# Altium schematic sheet IOT_Fire_Alarm_Sheet.SchDoc
size Letter; SheetNumber: 1; SheetTotal: 1
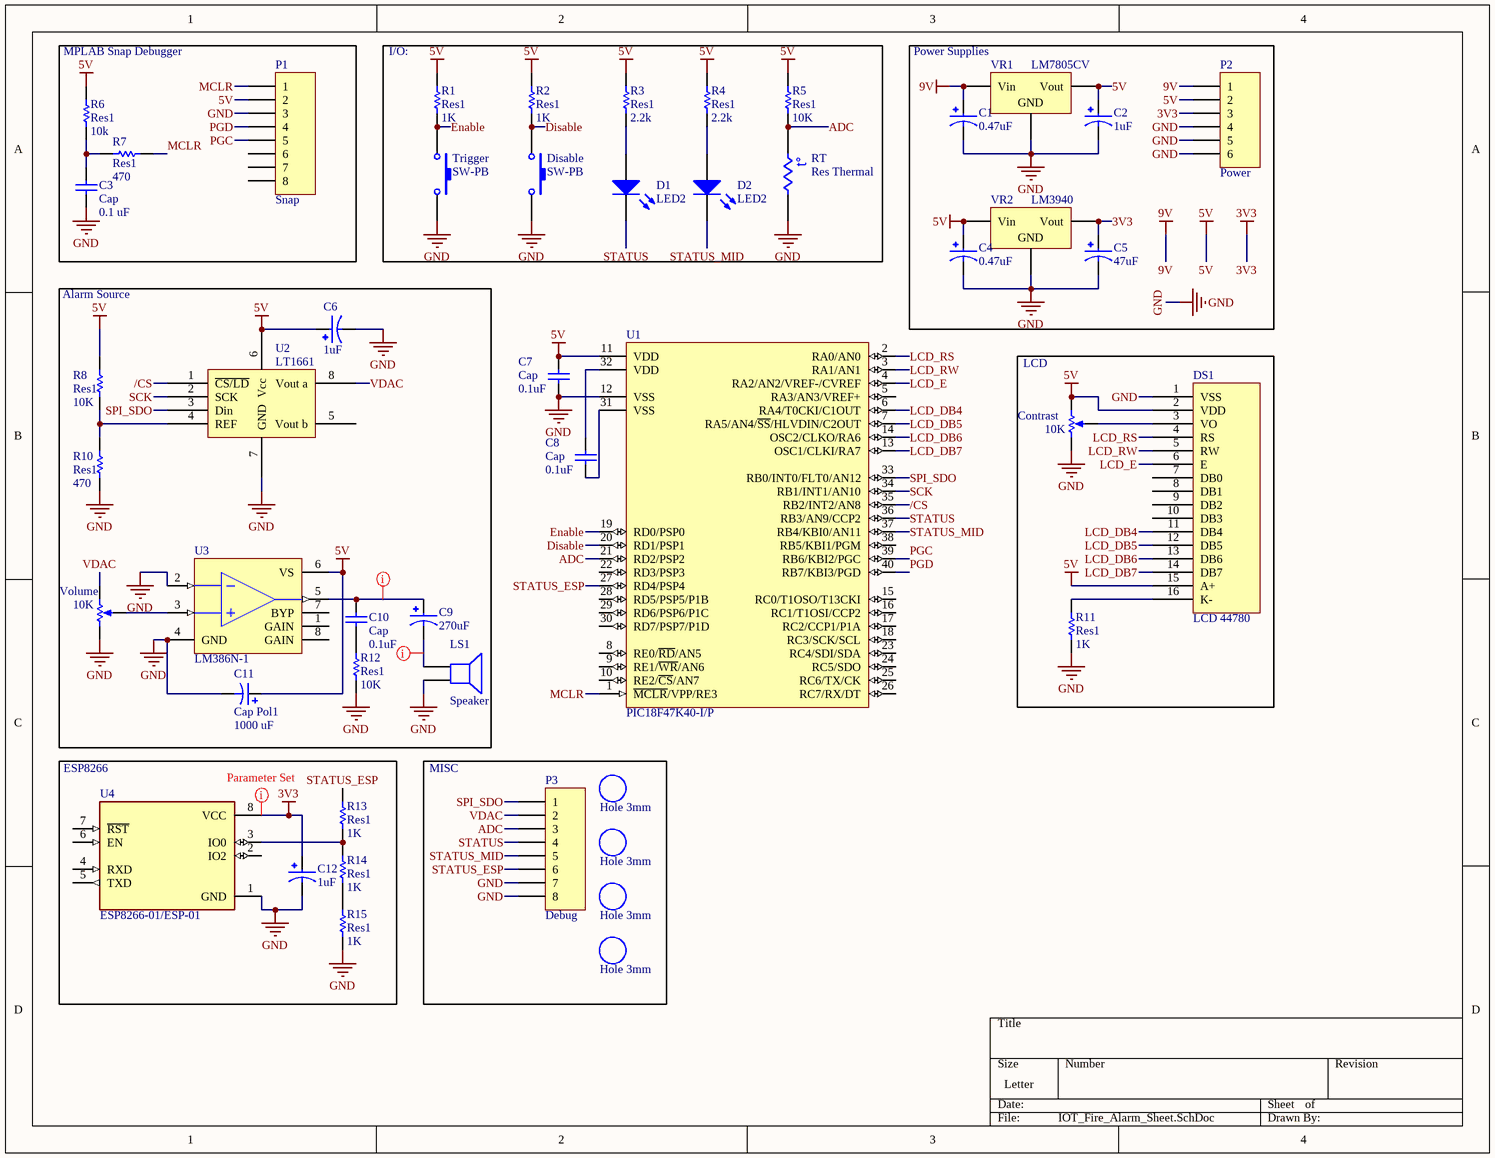
[diagram p0: IOT_Fire_Alarm_Sheet.SchDoc]

## Parts
C1  0.47uF  [CAPPRD200W50D500H1500]
C2  1uF  [CAPPRD200W50D500H1500]
C3  Cap  value 0.1 uF  [RAD-0.1]
C4  0.47uF  [CAPPRD200W50D500H1500]
C5  47uF  [CAPPRD200W50D500H1500]
C6  1uF  [CAPPRD200W50D500H1500]
C7  Cap  value 0.1uF  [RAD-0.1]
C8  Cap  value 0.1uF  [RAD-0.1]
C9  270uF  [CAPPRD500W60D1000H1250]
C10  Cap  value 0.1uF  [RAD-0.1]
C11  Cap Pol1  value 1000 uF  [RB7.6-15]
C12  1uF  [CAPPRD200W50D500H1500]
Contrast  value 10K  [POT inline wide]  (hidden comment: RPot_3)
D1  LED2  [LED-1]
D2  LED2  [LED-1]
Disable  SW-PB  [SW PB]
DS1  LCD 44780  [OLED 16x2]
H1  Hole 3mm  [Hole 3mm]
H2  Hole 3mm  [Hole 3mm]
H3  Hole 3mm  [Hole 3mm]
H4  Hole 3mm  [Hole 3mm]
LS1  Speaker  [PIN2]
P1  Snap  [HDR1X8]
P2  Power  [HDR1X6]
P3  Debug  [HDR1X8]
R1  Res1  value 1K  [AXIAL-0.3]
R2  Res1  value 1K  [AXIAL-0.3]
R3  Res1  value 2.2k  [AXIAL-0.3]
R4  Res1  value 2.2k  [AXIAL-0.3]
R5  Res1  value 10K  [AXIAL-0.3]
R6  Res1  value 10k  [AXIAL-0.3]
R7  Res1  value 470  [AXIAL-0.3]
R8  Res1  value 10K  [AXIAL-0.3]
R10  Res1  value 470  [AXIAL-0.3]
R11  Res1  value 1K  [AXIAL-0.3]
R12  Res1  value 10K  [AXIAL-0.3]
R13  Res1  value 1K  [AXIAL-0.3]
R14  Res1  value 1K  [AXIAL-0.3]
R15  Res1  value 1K  [AXIAL-0.3]
RT  Res Thermal  [RAD-0.2]
Trigger  SW-PB  [SW PB]
U1  PIC18F47K40-I/P  [DIP-40]
U2  LT1661  [DIP-8]
U3  LM386N-1  [DIP-8]
U4  ESP8266-01/ESP-01  [XCVR_ESP8266-01/ESP-01]
Volume  value 10K  [POT inline wide]  (hidden comment: RPot_3)
VR1  LM7805CV  [T03B]
VR2  LM3940  [T03B]

## Blocks framed on the sheet
MPLAB Snap Debugger: C3 P1 R6 R7
I/O:: D1 D2 Disable R1-R5 RT Trigger
Power Supplies: C1 C2 C4 C5 P2 VR1 VR2
Alarm Source: C6 C9-C11 LS1 R8 R10 R12 U2 U3 Volume
LCD: Contrast DS1 R11
ESP8266: C12 R13-R15 U4
MISC: H1-H4 P3

## Nets
3V3: C5.P C12.P P2.3 U4.8(VCC) VR2.3(Vout)
5V: C2.P C4.P C6.P C7.2 C11.1 Contrast.3(BOT) DS1.2(VDD) DS1.15(A+) P1.2 P2.2 R1.2 R2.2 R3.2 R4.2 R5.2 R6.2 R8.1 U1.11(VDD) U2.6(Vcc) U3.6(VS) VR1.3(Vout) VR2.1(Vin)
9V: C1.P P2.1 VR1.1(Vin)
GND: C1.N C2.N C3.1 C4.N C5.N C6.N C7.1 C11.2 C12.N Contrast.1(TOP) Disable.2 DS1.1(VSS) LS1.2 P1.3 P2.4 P2.5 P2.6 P3.7 P3.8 R10.1 R11.1 R12.1 R15.1 RT.2 Trigger.2 U1.12(VSS) U2.7(GND) U3.2(IN-) U3.4(GND) U4.1(GND) Volume.1(TOP) VR1.2(GND) VR2.2(GND)
/CS: U1.35(RB2/INT2/AN8) U2.1(~{CS/LD})
ADC: P3.3 R5.1 RT.1 U1.21(RD2/PSP2)
Disable: Disable.1 R2.1 U1.20(RD1/PSP1)
Enable: R1.1 Trigger.1 U1.19(RD0/PSP0)
LCD_DB4: DS1.11(DB4) U1.6(RA4/T0CKI/C1OUT)
LCD_DB5: DS1.12(DB5) U1.7(RA5/AN4/~{SS}/HLVDIN/C2OUT)
LCD_DB6: DS1.13(DB6) U1.14(OSC2/CLKO/RA6)
LCD_DB7: DS1.14(DB7) U1.13(OSC1/CLKI/RA7)
LCD_E: DS1.6(E) U1.4(RA2/AN2/VREF-/CVREF)
LCD_RS: DS1.4(RS) U1.2(RA0/AN0)
LCD_RW: DS1.5(RW) U1.3(RA1/AN1)
MCLR: P1.1 R7.2 U1.1(~{MCLR}/VPP/RE3)
PGC: P1.5 U1.39(RB6/KBI2/PGC)
PGD: P1.4 U1.40(RB7/KBI3/PGD)
SCK: U1.34(RB1/INT1/AN10) U2.2(SCK)
SPI_SDO: P3.1 U1.33(RB0/INT0/FLT0/AN12) U2.3(Din)
STATUS: D1.2(K) P3.4 U1.36(RB3/AN9/CCP2)
STATUS_ESP: P3.6 R13.2 U1.27(RD4/PSP4)
STATUS_MID: D2.2(K) P3.5 U1.37(RB4/KBI0/AN11)
VDAC: P3.2 U2.8(Vout_a) Volume.3(BOT)
NetC3_2: C3.2 R6.1 R7.1
NetC8_1: C8.1 U1.31(VSS)
NetC8_2: C8.2 U1.32(VDD)
NetC9_N: C9.N LS1.1
NetC9_P: C9.P C10.2 U3.5(OUT)
NetC10_1: C10.1 R12.2
NetContrast_2: Contrast.2(TAP) DS1.3(VO)
NetD1_1: D1.1(A) R3.1
NetD2_1: D2.1(A) R4.1
NetDS1_16: DS1.16(K-) R11.2
NetR8_2: R8.2 R10.2 U2.4(REF)
NetR13_1: R13.1 R14.2 U4.3(IO0)
NetR14_1: R14.1 R15.2
NetU3_3: U3.3(IN+) Volume.2(TAP)

Not connected (* = marked no-connect by the designer): DS1 7(DB0) 8(DB1) 9(DB2) 10(DB3); P1 6 7 8; U1 5(RA3/AN3/VREF+) 8(RE0/~{RD}/AN5) 9(RE1/~{WR}/AN6) 10(RE2/~{CS}/AN7) 15(RC0/T1OSO/T13CKI) 16(RC1/T1OSI/CCP2) 17(RC2/CCP1/P1A) 18(RC3/SCK/SCL) 22(RD3/PSP3) 23(RC4/SDI/SDA) 24(RC5/SDO) 25(RC6/TX/CK) 26(RC7/RX/DT) 28(RD5/PSP5/P1B) 29(RD6/PSP6/P1C) 30(RD7/PSP7/P1D) 38(RB5/KBI1/PGM); U2 5(Vout_b); U3 1(GAIN) 7(BYP) 8(GAIN); U4 2(IO2) 4(RXD) 5(TXD) 6(EN) 7(~{RST})

## Layout directives
rule Width Constraint [Pref Width = 30mil    Min Width = 20mil    Max Width = 40mil]: 3V3
rule Width Constraint [Pref Width = 30mil    Min Width = 20mil    Max Width = 30mil]: NetC9_N, NetC9_P

## Notes on the sheet
- (in symbol Res Thermal) t°

## Library data of the parts
C1 C2 C4-C6 C12 = EEUEB1J1R0: 1F 63V Aluminum Electrolytic Capacitors Radial, Can 5000 Hrs @ 105C; MP: EEU-EB1J1R0; MF: Panasonic Electronic Components; Price: None; Value: *; Package: RADIAL-2 Panasonic; Check_prices: https://www.snapeda.com/parts/EEU-EB1J1R0/Panasonic/view-part/6221748/?ref=eda; SnapEDA_Link: https://www.snapeda.com/parts/EEU-EB1J1R0/Panasonic/view-part/6221748/?ref=snap; Availability: Not in stock
C3 C7 C8 C10 = Cap: Capacitor; Published: 8-Jun-2000; LatestRevisionDate: 17-Jul-2002; LatestRevisionNote: Re-released for DXP Platform.; PackageReference: RAD-0.3; Publisher: Altium Limited; PackageDescription: Radial Cap, Thru-Hole; 2 Leads; 0.3 in Pin Spacing
C9 = EEUFC1J101: Capacitor; Aluminum Electrolytic; Radial Al Electrolytic Cap; 100uF 63V; MF: Panasonic Electronic; MP: EEU-FC1J101; Package: RADIAL-2 Panasonic; Price: None; Check_prices: https://www.snapeda.com/parts/EEU-FC1J101/Panasonic%20Electronic%20Components/view-part/494707/?ref=eda; Value: *; SnapEDA_Link: https://www.snapeda.com/parts/EEU-FC1J101/Panasonic%20Electronic%20Components/view-part/494707/?ref=snap; Availability: In Stock
C11 = Cap Pol1: Polarized Capacitor (Radial); Published: 8-Jun-2000; LatestRevisionDate: 17-Jul-2002; LatestRevisionNote: Re-released for DXP Platform.; PackageReference: RB7.6-15; Publisher: Altium Limited; PackageDescription: Polarized Capacitor (Radial); 2 Leads
Contrast Volume = RPot: Potentiometer; Sim Note: Enter the Resistance value and the set point into parameter fields.; Set Position: 0.5; Published: 8-Jun-2000; LatestRevisionDate: 17-Jul-2002; LatestRevisionNote: Re-released for DXP Platform.; Publisher: Altium Limited
D1 D2 = LED2: Typical RED, GREEN, YELLOW, AMBER GaAs LED; Published: 8-Jun-2000; LatestRevisionDate: 17-Jul-2002; LatestRevisionNote: Re-released for DXP Platform.; PackageVersion: Feb-2002; PackageReference: 3.2X1.6X1.1; Publisher: Altium Limited; PackageDescription: SM LED; 2 Flat Leads
Disable Trigger = SW-PB: DIGIKEY SW400-ND; Published: 24-Mar-1999; LatestRevisionDate: 17-Jul-2002; LatestRevisionNote: Re-released for DXP Platform.; Publisher: Altium Limited
LS1 = Speaker: Loudspeaker; Published: 24-Mar-1999; LatestRevisionDate: 17-Jul-2002; LatestRevisionNote: Re-released for DXP Platform.; PackageReference: PIN2; Publisher: Altium Limited
P1 P3 = Header 8: Header, 8-Pin; LatestRevisionDate: 17-Jul-2002; LatestRevisionNote: Re-released for DXP Platform.; Publisher: Altium Limited
P2 = Header 6: Header, 6-Pin; LatestRevisionDate: 17-Jul-2002; LatestRevisionNote: Re-released for DXP Platform.; Publisher: Altium Limited
R1-R8 R10-R15 = Res1: Resistor; Published: 8-Jun-2000; LatestRevisionDate: 17-Jul-2002; LatestRevisionNote: Re-released for DXP Platform.; PackageReference: AXIAL-0.3; Publisher: Altium Limited; PackageDescription: Axial Device, Thru-Hole; 2 Leads; 0.3 in Pin Spacing
RT = Res Thermal: Thermistor; Published: 24-Mar-1999; LatestRevisionDate: 29-May-2009; LatestRevisionNote: IPC-7351 Footprint Added.; PackageVersion: Mar-2003; PackageReference: 6-0805; Publisher: Altium Limited; PackageDescription: Chip Resistor 0805 Case Size; Code_IPC: RESC2012
U1 = PIC18F4620-I/P_1: Enhanced Flash Microcontroller with 10-Bit A/D and nanoWatt Technology, 64K Flash, 40-Pin PDIP, Industrial Temperature Range; DatasheetVersion: revE, May-2008; PackageVersion: revBB, Aug-2009; PackageReference: PDIP600-P40; PackageDescription: 40-Lead Plastic Dual In-Line (P) - 600 mil Body [PDIP]; ComponentLink1Description: Manufacturer URL; ComponentLink1URL: http://www.microchip.com/; ComponentLink2Description: Datasheet; ComponentLink2URL: http://ww1.microchip.com/downloads/en/DeviceDoc/39626e.pdf; ComponentLink3Description: Package Specification; ComponentLink3URL: http://www.microchip.com/stellent/groups/techpub_sg/documents/packagingspec/en012702.pdf
U3 = LM386N-1: Low-Voltage Audio Power Amplifier; Published: 15-Apr-2002; DatasheetDocument: Sep-1997; PackageDocument: Sep-1997; PackageReference: N08E; Publisher: Altium Limited
U4 = ESP8266-01/ESP-01: MakerFocus 4pcs ESP8266 ESP-01 Serial Wireless WiFi Transceiver Receiver Module 1MB SPI Flash DC3.0-3.6V Internet of Things WiFi Module Board Compatible with Ar duino; MF: AI-Thinker; SnapEDA_Link: https://www.snapeda.com/parts/ESP8266-01/ESP-01/AI-Thinker/view-part/?ref=snap; Availability: Not in stock; Price: None; Package: Non-Standard AI-Thinker; Check_prices: https://www.snapeda.com/parts/ESP8266-01/ESP-01/AI-Thinker/view-part/?ref=eda; Value: *; MP: ESP8266-01/ESP-01
VR1 VR2 = Volt Reg: Voltage Regulator; Published: 24-Mar-1999; LatestRevisionDate: 29-May-2009; LatestRevisionNote: IPC-7351 Footprint Added.; PackageReference: D2PAK; Publisher: Altium Limited; PackageDescription: 3-Pin Transistor Outline Package 2.54 mm Pitch, 15.1 mm Lead Span